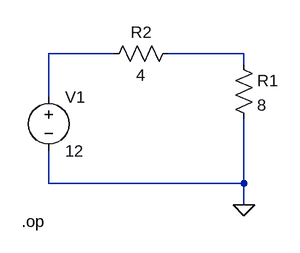
[diagram p0: schematic series_voltage_divider.asc]
series_voltage_divider.asc, the LTspice schematic file:
Version 4
SHEET 1 880 680
WIRE 176 64 80 64
WIRE 368 64 256 64
WIRE 368 80 368 64
WIRE 80 128 80 64
WIRE 80 256 80 208
WIRE 368 256 368 160
WIRE 368 256 80 256
WIRE 368 288 368 256
FLAG 368 288 0
SYMBOL voltage 80 112 R0
SYMATTR InstName V1
SYMATTR Value 12
SYMBOL res 352 64 R0
SYMATTR InstName R1
SYMATTR Value 8
SYMBOL res 272 48 R90
WINDOW 0 0 56 VBottom 2
WINDOW 3 32 56 VTop 2
SYMATTR InstName R2
SYMATTR Value 4
TEXT 40 312 Left 2 !.op

The netlist it stands for:
* series_voltage_divider.asc
V1 N001 0 12
R1 N002 0 8
R2 N002 N001 4
.op
.backanno
.end